# EAGLE schematic PFE (EAGLE 9.6.2)
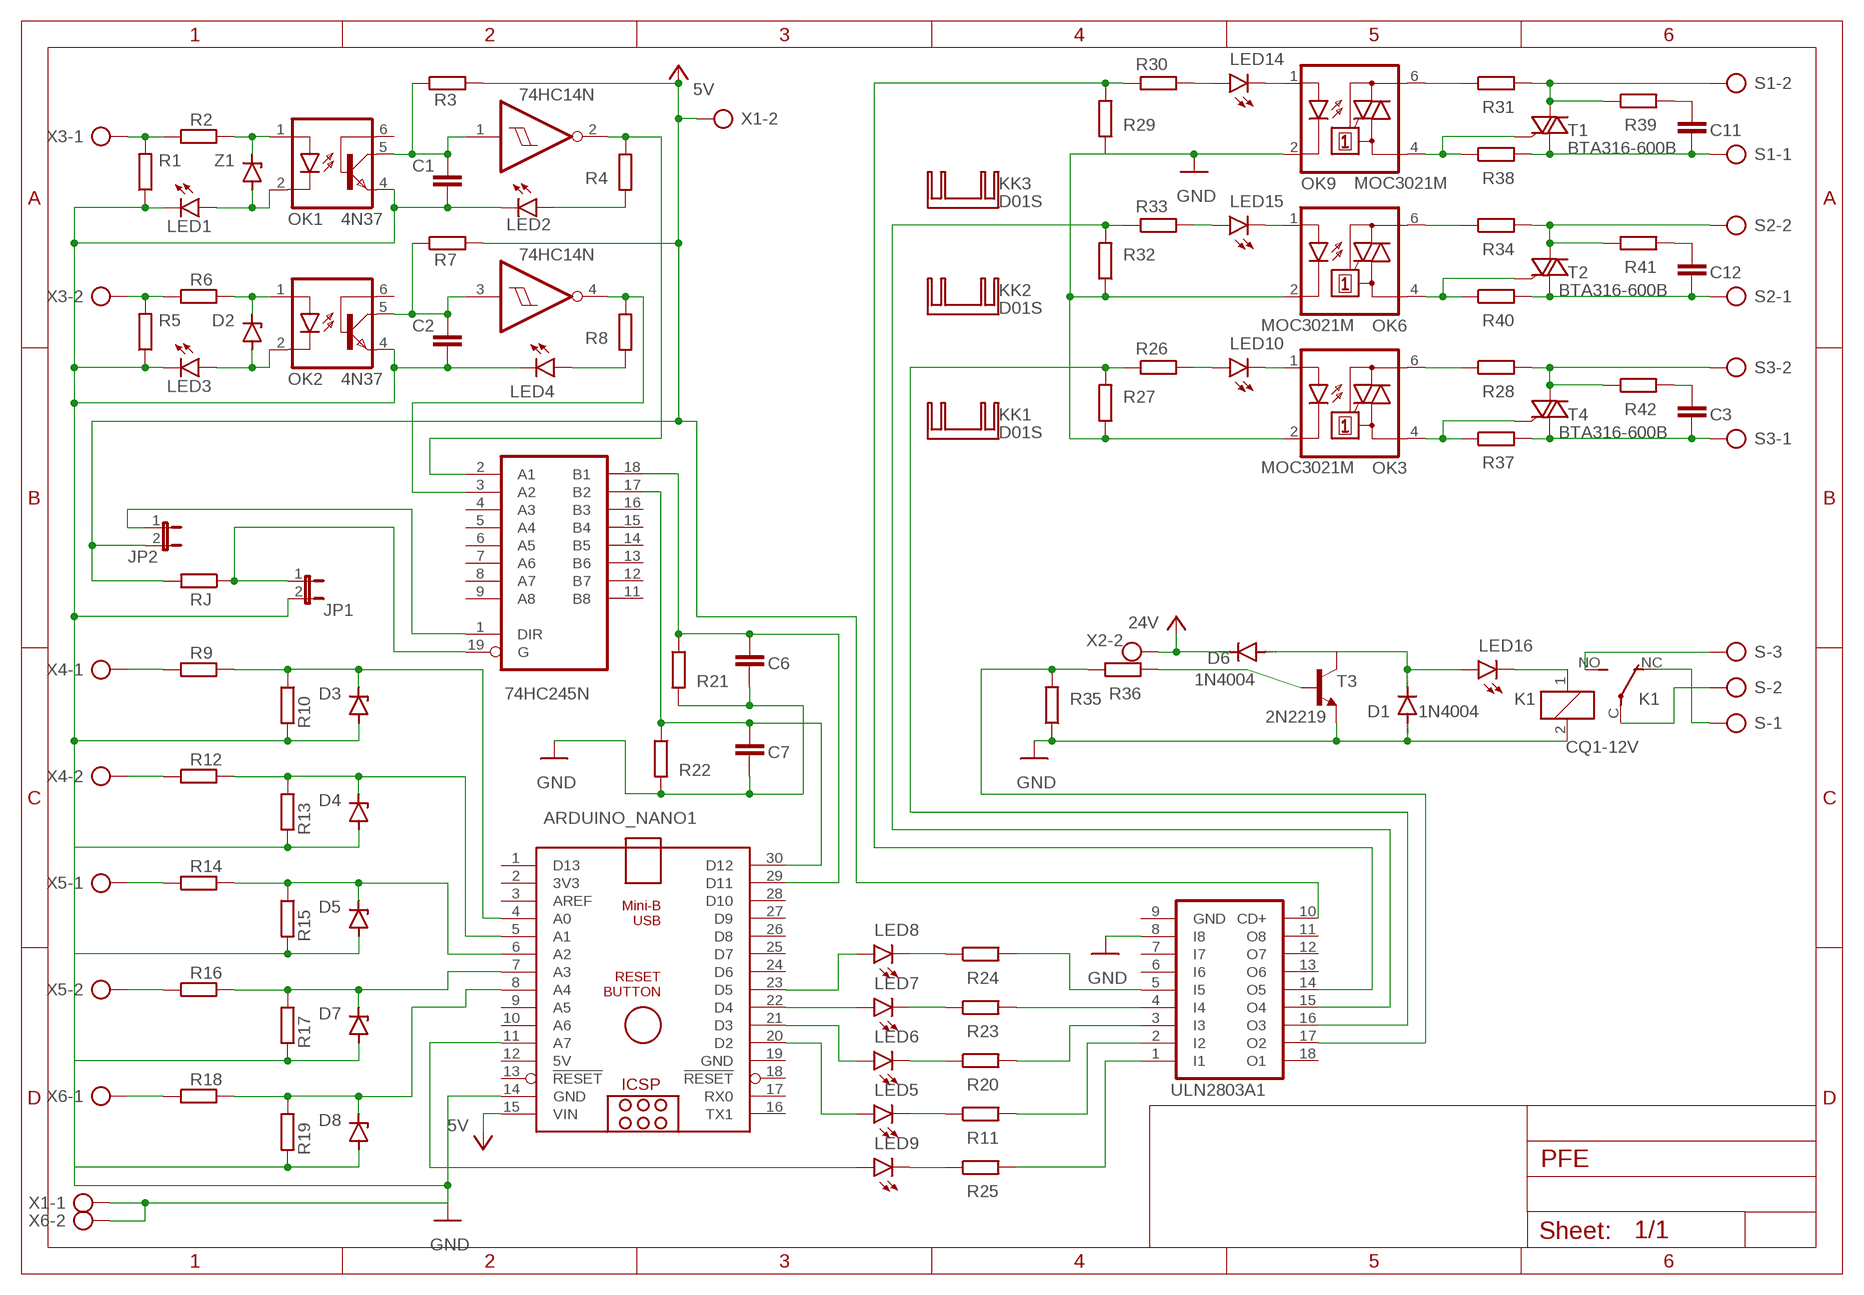
[diagram p0: schematic, sheet 1]

## Parts
ARDUINO_NANO1  ARDUINO_NANO  [ARDUINO_NANO]
C1  C-EU075-052X106  [C075-052X106]
C2  C-EU075-052X106  [C075-052X106]
C3  C-EU075-052X106  [C075-052X106]
C6  C-EU075-052X106  [C075-052X106]
C7  C-EU075-052X106  [C075-052X106]
C11  C-EU075-052X106  [C075-052X106]
C12  C-EU075-052X106  [C075-052X106]
D1  1N4004  [DO41-10]
D2  1N4728  [DO41Z10]
D3  1N4728  [DO41Z10]
D4  1N4728  [DO41Z10]
D5  1N4728  [DO41Z10]
D6  1N4004  [DO41-10]
D7  1N4728  [DO41Z10]
D8  1N4728  [DO41Z10]
IC1  74HC14N  [DIL14]
IC2  74HC245N  [DIL20]
JP1  JP1E  [JP1]
JP2  JP1E  [JP1]
K1  CQ1-12V  [CQ1]
KK1  D01S  [D01S]
KK2  D01S  [D01S]
KK3  D01S  [D01S]
LED1  TLLY4400  [LED3MM]
LED2  TLLY4400  [LED3MM]
LED3  TLLY4400  [LED3MM]
LED4  TLLY4400  [LED3MM]
LED5  TLLY4400  [LED3MM]
LED6  TLLY4400  [LED3MM]
LED7  TLLY4400  [LED3MM]
LED8  TLLY4400  [LED3MM]
LED9  TLLY4400  [LED3MM]
LED10  TLLY4400  [LED3MM]
LED14  TLLY4400  [LED3MM]
LED15  TLLY4400  [LED3MM]
LED16  TLLY4400  [LED3MM]
OK1  4N37  [DIL06]
OK2  4N37  [DIL06]
OK3  MOC3021M  [DIL06]
OK6  MOC3021M  [DIL06]
OK9  MOC3021M  [DIL06]
R1  R-EU_0204/7  [0204/7]
R2  R-EU_0204/7  [0204/7]
R3  R-EU_0204/7  [0204/7]
R4  R-EU_0204/7  [0204/7]
R5  R-EU_0204/7  [0204/7]
R6  R-EU_0204/7  [0204/7]
R7  R-EU_0204/7  [0204/7]
R8  R-EU_0204/7  [0204/7]
R9  R-EU_0204/7  [0204/7]
R10  R-EU_0204/7  [0204/7]
R11  R-EU_0204/7  [0204/7]
R12  R-EU_0204/7  [0204/7]
R13  R-EU_0204/7  [0204/7]
R14  R-EU_0204/7  [0204/7]
R15  R-EU_0204/7  [0204/7]
R16  R-EU_0204/7  [0204/7]
R17  R-EU_0204/7  [0204/7]
R18  R-EU_0204/7  [0204/7]
R19  R-EU_0204/7  [0204/7]
R20  R-EU_0204/7  [0204/7]
R21  R-EU_0204/7  [0204/7]
R22  R-EU_0204/7  [0204/7]
R23  R-EU_0204/7  [0204/7]
R24  R-EU_0204/7  [0204/7]
R25  R-EU_0204/7  [0204/7]
R26  R-EU_0204/7  [0204/7]
R27  R-EU_0204/7  [0204/7]
R28  R-EU_0204/7  [0204/7]
R29  R-EU_0204/7  [0204/7]
R30  R-EU_0204/7  [0204/7]
R31  R-EU_0204/7  [0204/7]
R32  R-EU_0204/7  [0204/7]
R33  R-EU_0204/7  [0204/7]
R34  R-EU_0204/7  [0204/7]
R35  R-EU_0204/7  [0204/7]
R36  R-EU_0204/7  [0204/7]
R37  R-EU_0204/7  [0204/7]
R38  R-EU_0204/7  [0204/7]
R39  R-EU_0204/7  [0204/7]
R40  R-EU_0204/7  [0204/7]
R41  R-EU_0204/7  [0204/7]
R42  R-EU_0204/7  [0204/7]
RJ  R-EU_0204/7  [0204/7]
S  AK300/3  [AK300/3]
S1  AK300/2  [AK300/2]
S2  AK300/2  [AK300/2]
S3  AK300/2  [AK300/2]
T1  BTA316-600B  [SOT78A]
T2  BTA316-600B  [SOT78A]
T3  2N2219  [TO5]
T4  BTA316-600B  [SOT78A]
ULN2803A1  ULN2803A  [DIL18]
X1  AK300/2  [AK300/2]
X2  AK300/2  [AK300/2]
X3  AK300/2  [AK300/2]
X4  AK300/2  [AK300/2]
X5  AK300/2  [AK300/2]
X6  AK300/2  [AK300/2]
Z1  1N4728  [DO41Z10]

## Nets
GND: ARDUINO_NANO1.14(GND) C1.2 C2.2 C6.2 C7.2 D1.A D3.A JP1.2 K1.2 LED1.K(C) LED2.K(C) LED3.K(C) LED4.K(C) OK1.4(EMI) OK2.4(EMI) OK3.2(C) OK6.2(C) OK9.2(C) R1.1 R5.1 R10.2 R21.2 R22.2 R27.1 R29.1 R32.1 R35.1 T3.1(E) ULN2803A1.8(I8) X1.1 X6.2
GND1: D4.A R13.2
GND2: D5.A R15.2
GND3: D7.A R17.2
GND4: D8.A R19.2
N$1: R1.2 R2.1 X3.1
N$2: D2.A LED3.A OK2.2(C)
N$3: OK1.1(A) R2.2 Z1.C
N$4: C1.1 IC1.1(D:I) OK1.5(COL) R3.1
N$5: C3.2 R37.2 S3.1 T4.T1(CM)
N$6: D2.C OK2.1(A) R6.2
N$7: ARDUINO_NANO1.11(A7) LED9.A
N$8: R5.2 R6.1 X3.2
N$9: C2.1 IC1.3(E:I) OK2.5(COL) R7.1
N$10: LED6.K(C) R20.1
N$11: ARDUINO_NANO1.4(A0) D3.C R9.2 R10.1
N$12: ARDUINO_NANO1.29(D11) C6.1 IC2.18(B1) R21.1
N$13: R9.1 X4.1
N$14: R28.2 R42.1 S3.2 T4.T2(LD)
N$15: LED4.A R8.2
N$16: R12.1 X4.2
N$17: LED10.A R26.2
N$18: LED1.A OK1.2(C) Z1.A
N$19: IC1.4(E:O) IC2.3(A2) R8.1
N$20: ARDUINO_NANO1.6(A2) D5.C R14.2 R15.1
N$21: R14.1 X5.1
N$22: LED7.K(C) R23.1
N$23: R16.1 X5.2
N$24: ARDUINO_NANO1.22(D4) LED7.A
N$25: IC2.19(G) JP1.1 RJ.1
N$26: LED14.A R30.2
N$27: R18.1 X6.1
N$28: OK6.4(A1) R40.1 T2.G
N$29: R32.2 R33.1 ULN2803A1.15(O4)
N$30: ARDUINO_NANO1.5(A1) D4.C R12.2 R13.1
N$31: LED2.A R4.2
N$32: R25.2 ULN2803A1.1(I1)
N$33: LED10.K(C) OK3.1(A)
N$34: ARDUINO_NANO1.7(A3) D7.C R16.2 R17.1
N$35: LED14.K(C) OK9.1(A)
N$36: ARDUINO_NANO1.8(A4) D8.C R18.2 R19.1
N$37: OK3.6(A2) R28.1
N$38: LED15.A R33.2
N$39: IC2.1(DIR) JP2.1
N$40: ARDUINO_NANO1.23(D5) LED8.A
N$41: R11.2 ULN2803A1.2(I2)
N$42: LED15.K(C) OK6.1(A)
N$43: ARDUINO_NANO1.30(D12) C7.1 IC2.17(B2) R22.1
N$44: IC1.2(D:O) IC2.2(A1) R4.1
N$45: LED5.K(C) R11.1
N$46: LED8.K(C) R24.1
N$47: R36.2 T3.2(B)
N$48: K1.NO(2:S) S.3
N$49: LED9.K(C) R25.1
N$50: R20.2 ULN2803A1.3(I3)
N$51: ARDUINO_NANO1.20(D2) LED5.A
N$52: R23.2 ULN2803A1.4(I4)
N$53: OK9.4(A1) R38.1 T1.G
N$54: C3.1 R42.2
N$55: R35.2 R36.1 ULN2803A1.17(O2)
N$56: D1.C D6.A LED16.A T3.3(C)
N$57: OK9.6(A2) R31.1
N$58: OK6.6(A2) R34.1
N$59: R31.2 R39.1 S1.2 T1.T2(LD)
N$60: R29.2 R30.1 ULN2803A1.14(O5)
N$61: C11.1 R39.2
N$62: C12.1 R41.2
N$63: K1.NC(2:O) S.1
N$64: K1.C(2:P) S.2
N$65: C11.2 R38.2 S1.1 T1.T1(CM)
N$66: ARDUINO_NANO1.21(D3) LED6.A
N$67: R34.2 R41.1 S2.2 T2.T2(LD)
N$68: K1.1 LED16.K(C)
N$69: OK3.4(A1) R37.1 T4.G
N$70: R24.2 ULN2803A1.5(I5)
N$71: C12.2 R40.2 S2.1 T2.T1(CM)
N$72: R26.1 R27.2 ULN2803A1.16(O3)
VCC: ARDUINO_NANO1.15(VIN) D6.C JP2.2 R3.2 R7.2 RJ.2 ULN2803A1.10(CD+) X1.2 X2.2 ; supply symbol labelled 5V, 24V
Unconnected: ARDUINO_NANO1.1(D13) ARDUINO_NANO1.2(3V3) ARDUINO_NANO1.3(AREF) ARDUINO_NANO1.9(A5) ARDUINO_NANO1.10(A6) ARDUINO_NANO1.13(!RESET) ARDUINO_NANO1.16(TX1) ARDUINO_NANO1.17(RX0) ARDUINO_NANO1.18(!RESET) ARDUINO_NANO1.24(D6) ARDUINO_NANO1.25(D7) ARDUINO_NANO1.26(D8) ARDUINO_NANO1.27(D9) ARDUINO_NANO1.28(D10) IC1.5(F:I) IC1.6(F:O) IC1.8(C:O) IC1.9(C:I) IC1.10(B:O) IC1.11(B:I) IC1.12(A:O) IC1.13(A:I) IC2.4(A3) IC2.5(A4) IC2.6(A5) IC2.7(A6) IC2.8(A7) IC2.9(A8) IC2.11(B8) IC2.12(B7) IC2.13(B6) IC2.14(B5) IC2.15(B4) IC2.16(B3) OK1.6(BAS) OK2.6(BAS) ULN2803A1.6(I6) ULN2803A1.7(I7) ULN2803A1.11(O8) ULN2803A1.12(O7) ULN2803A1.13(O6) ULN2803A1.18(O1) X2.1

## Power pins joined to a net without a drawn wire
5V: ARDUINO_NANO1.12(5V)
GND: ARDUINO_NANO1.19(GND) IC1.7(P:GND) IC2.10(GND) ULN2803A1.9(GND)
VCC: IC1.14(P:VCC) IC2.20(VCC)

## Library data of the parts
ARDUINO_NANO1 = ArduinoNanoV30:ARDUINO_NANO: Arduino Nano V3.0 Overview: The Arduino Nano is a small, complete, and breadboard-friendly board based on the ATmega328 (Arduino Nano 3.x) or ATmega168 (Arduino Nano 2.x). It has more or less the same functionality of the Arduino Duemilanove, but in a different package. It lacks only a DC power jack, and works with a Mini-B USB cable instead of a standard one. The Nano was designed and is being produced by Gravitech. Specifications: Microcontroller Atmel ATmega168 or ATmega328 Operating Voltage (logic level) 5 V Input Voltage (recommended) 7-12 V Input Voltage (limits) 6-20 V Digital I/O Pins 14 (of which 6 provide PWM output) Analog Input Pins 8 DC Current per I/O Pin 40 mA Flash Memory 16 KB (ATmega168) or 32 KB (ATmega328) of which 2 KB used by bootloader SRAM 1 KB (ATmega168) or 2 KB (ATmega328) EEPROM 512 bytes (ATmega168) or 1 KB (ATmega328) Clock Speed 16 MHz Dimensions 0.73" x 1.70" Length 45 mm Width 18 mm Weigth 5 g Power: The Arduino Nano can be powered via the Mini-B USB connection, 6-20V unregulated external power supply (pin 30), or 5V regulated external power supply (pin 27). The power source is automatically selected to the highest voltage source. Memory: The ATmega168 has 16 KB of flash memory for storing code (of which 2 KB is used for the bootloader); the ATmega328 has 32 KB, (also with 2 KB used for the bootloader). The ATmega168 has 1 KB of SRAM and 512 bytes of EEPROM (which can be read and written with the EEPROM library); the ATmega328 has 2 KB of SRAM and 1 KB of EEPROM. Input and Output: Each of the 14 digital pins on the Nano can be used as an input or output, using pinMode(), digitalWrite(), and digitalRead() functions. They operate at 5 volts. Each pin can provide or receive a maximum of 40 mA and has an internal pull-up resistor (disconnected by default) of 20-50 kOhms. In addition, some pins have specialized functions. Visit Arduino - ArduinoBoardNano <https://www.arduino.cc/en/Main/ArduinoBoardNano>
C1-C3 C6 C7 C11 C12 = rcl:C-EU: CAPACITOR, European symbol; SPICEPREFIX: C
D1 D6 = diode:1N4004: DIODE general purpose rectifier, 1 A
D2-D5 D7 D8 Z1 = diode:1N4728: Z DIODE 3.3 V, 1W, 5 percent
IC1 = 74xx-eu:74*14: Hex schmitt trigger INVERTER
IC2 = 74xx-eu:74*245: Octal BUS TRANSCEIVER, 3-state
JP1 JP2 = jumper:JP1E: JUMPER
K1 = relay:CQ1-12V: AUTOMOTIVE QUIET RELAY NAiS Source: http://www.mew-europe.com/.. en_ds_61208_0000.pdf; OC_FARNELL: unknown; OC_NEWARK: unknown
KK1-KK3 = heatsink:D01S: HEATSINK distributor Schukat
LED1-LED10 LED14-LED16 = led:TLLY4400: Low Current (2mA) LED 3 mm Tinted Diffused Package color YELLOW Source: Data sheet <http://www.farnell.com/datasheets/391098.pdf>; MF: VISHAY SEMICONDUCTOR; OC_FARNELL: 1612439
OK1 OK2 = optocoupler:4N37: OPTO COUPLER Source: http://www.fairchildsemi.com/pf/4N/4N35-M.html; MF: FAIRCHILD SEMICONDUCTOR; MPN: 4N37; OC_FARNELL: 1612456; OC_NEWARK: 72K9948
OK3 OK6 OK9 = optocoupler:MOC30*M: RANDOM-PHASE OPTOISOLATORS TRIAC DRIVER OUTPUT Source: http://www.fairchildsemi.com MOC3020-M.pdf; MF: FAIRCHILD SEMICONDUCTOR; MPN: MOC3021-M; OC_FARNELL: 1021365; OC_NEWARK: 95B7895
R1-R42 RJ = rcl:R-EU_: RESISTOR, European symbol; SPICEPREFIX: R
S = con-ptr500:AK300/3: CONNECTOR; OC_FARNELL: unknown; OC_NEWARK: unknown
S1-S3 X1-X6 = con-ptr500:AK300/2: CONNECTOR; OC_FARNELL: unknown; OC_NEWARK: unknown
T1 T2 T4 = nxp_60:BTA316: Planar passivated high commutation three quadrant triac in a SOT78 plastic package intended for use in circuits where high static and dynamic dV/dt and high dI/dt can occur AAL Eindhoven MV+ MK; 12NC: 9340 600 72127
T3 = transistor:2N2219: NPN TRANSISTOR
ULN2803A1 = uln-udn:ULN2803A: DRIVER ARRAY